# Altium schematic sheet [2]DotexBoard_ENC28J60.SchDoc
size B
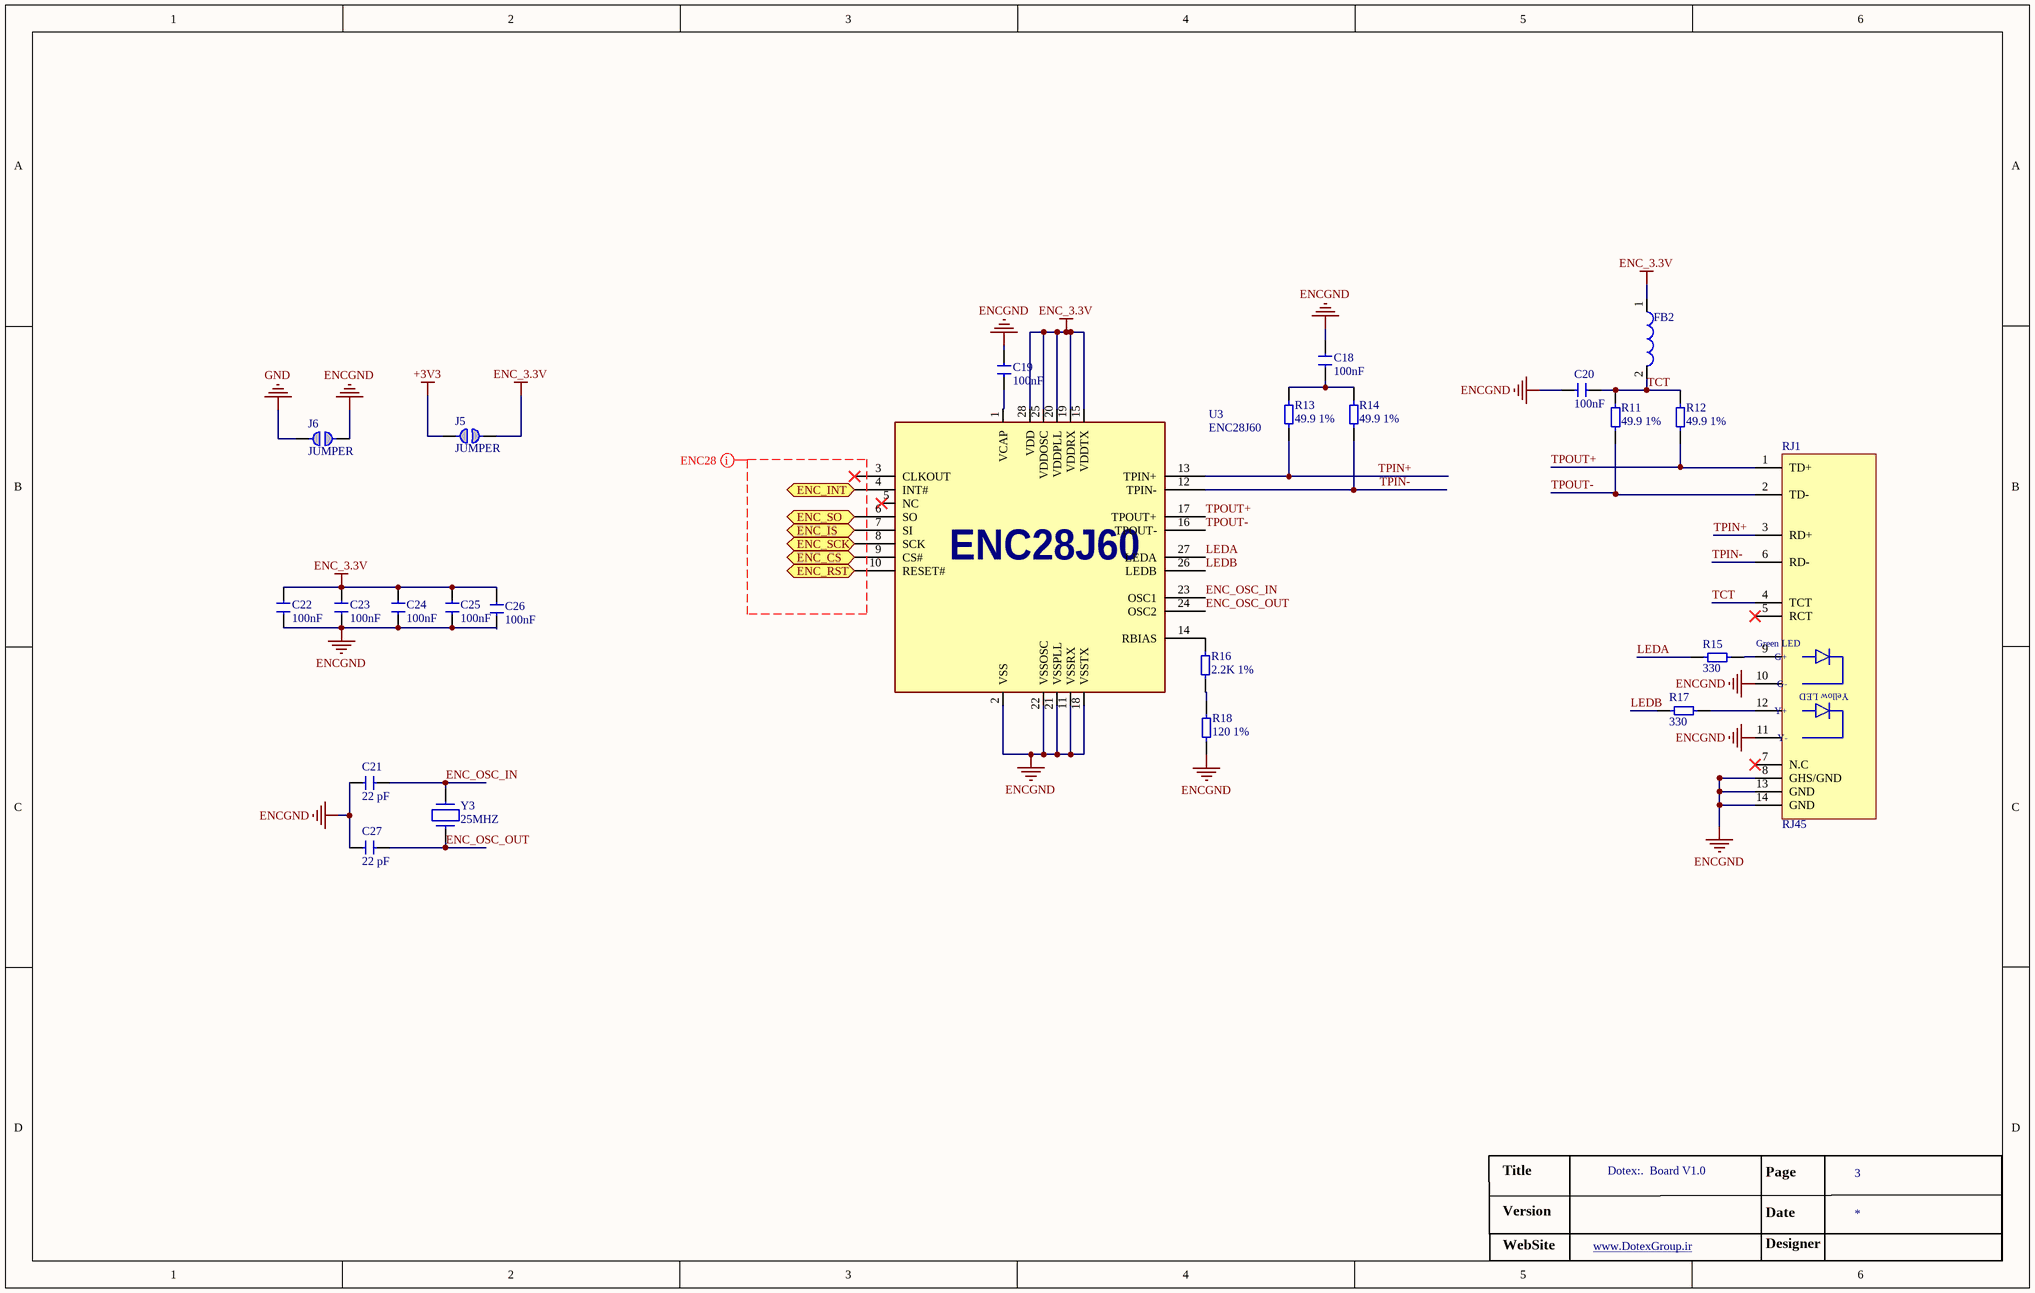
[diagram p0: [2]DotexBoard_ENC28J60.SchDoc]

## Parts
C18  Comment  [0805 Capacitor]  (value not drawn)
C19  Comment  [0805 Capacitor]  (value not drawn)
C20  Comment  [0805 Capacitor]  (value not drawn)
C21  Comment  [0805 Capacitor]  (value not drawn)
C22  Comment  [0805 Capacitor]  (value not drawn)
C23  Comment  [0805 Capacitor]  (value not drawn)
C24  Comment  [0805 Capacitor]  (value not drawn)
C25  Comment  [0805 Capacitor]  (value not drawn)
C26  Comment  [0805 Capacitor]  (value not drawn)
C27  Comment  [0805 Capacitor]  (value not drawn)
FB2  Comment  [0805 Ferrit Bead]  (value not drawn)
J5  JUMPER  [0603 Resistor]
J6  JUMPER  [0603 Resistor]
R11  Comment  [0805 Resistor]  (value not drawn)
R12  Comment  [0805 Resistor]  (value not drawn)
R13  Comment  [0805 Resistor]  (value not drawn)
R14  Comment  [0805 Resistor]  (value not drawn)
R15  Comment  [0805 Resistor]  (value not drawn)
R16  Comment  [0805 Resistor]  (value not drawn)
R17  Comment  [0805 Resistor]  (value not drawn)
R18  Comment  [0805 Resistor]  (value not drawn)
RJ1  RJ45  [HR91105A-RJ45]
U3  value ENC28J60  [SO_28_W]  (hidden comment: Comment)
Y3  25MHZ  [Xtal 2p]

## Ports
ENC_CS (bidir), ENC_INT (bidir), ENC_IS (bidir), ENC_RST (bidir), ENC_SCK (bidir), ENC_SO (bidir)

## Nets
+3V3: J5.1
ENC_3.3V: C22.2 C23.2 C24.2 C25.2 C26.2 FB2.1 J5.2 U3.15(VDDTX) U3.19(VDDRX) U3.20(VDDPLL) U3.25(VDDOSC) U3.28(VDD)
ENCGND: C18.1 C19.2 C20.2 C21.1 C22.1 C23.1 C24.1 C25.1 C26.1 C27.2 J6.2 R18.2 RJ1.8(GHS/GND) RJ1.10 RJ1.11 RJ1.13(GND) RJ1.14(GND) U3.2(VSS) U3.11(VSSRX) U3.18(VSSTX) U3.21(VSSPLL) U3.22(VSSOSC)
GND: J6.1
ENC_CS: U3.9(CS#) ; port ENC_CS
ENC_INT: U3.4(INT#) ; port ENC_INT
ENC_IS: U3.7(SI) ; port ENC_IS
ENC_OSC_IN: C21.2 U3.23(OSC1) Y3.2
ENC_OSC_OUT: C27.1 U3.24(OSC2) Y3.1
ENC_RST: U3.10(RESET#) ; port ENC_RST
ENC_SCK: U3.8(SCK) ; port ENC_SCK
ENC_SO: U3.6(SO) ; port ENC_SO
LEDA: R15.1 U3.27(LEDA)
LEDB: R17.2 U3.26(LEDB)
TCT: C20.1 FB2.2 R11.1 R12.1 RJ1.4(TCT)
TPIN+: R13.2 RJ1.3(RD+) U3.13(TPIN+)
TPIN-: R14.2 RJ1.6(RD-) U3.12(TPIN-)
TPOUT+: R12.2 RJ1.1(TD+) U3.17(TPOUT+)
TPOUT-: R11.2 RJ1.2(TD-) U3.16(TPOUT-)
NetC18_2: C18.2 R13.1 R14.1
NetC19_1: C19.1 U3.1(VCAP)
NetR15_2: R15.2 RJ1.9
NetR16_1: R16.1 U3.14(RBIAS)
NetR16_2: R16.2 R18.1
NetR17_1: R17.1 RJ1.12

Not connected (* = marked no-connect by the designer): RJ1 5(RCT)* 7(N.C)*; U3 3(CLKOUT)* 5(NC)*

## Layout directives
net class ENC28: (no net found under the mark)

## Notes on the sheet
- Title
- Dotex:.  Board V1.0
- Page
- 3
- Version
- Date
- Designer
- WebSite
- www.DotexGroup.ir <http://www.DotexGwww.DotexGroup.irroup.ir>
- Size:
- Date:
- B
- Number:
- Time:
- Revision:
- Sheet
- of
- File:
- (in symbol Capacitor SMD) 22 pF; 100nF
- (in symbol HR911105A) Green LED; G+; G-; Yellow LED; Y+; Y-
- (in symbol Resistor SMD) 2.2K 1%; 330; 49.9 1%; 120 1%

## Library data of the parts
C18-C27 = Capacitor SMD
FB2 = Ferrit Bead
J5 J6 = jumper SMD
R11-R18 = Resistor SMD
RJ1 = HR911105A
U3 = ENC28J60_SOP: Ethernet Controller, 10/100, MII/RMII; MANF: Microchip; MANF_P#: ENC28J60-I/SO, ENC28J60-C/SO
Y3 = Xtal